# EAGLE schematic StepToneGenerator (EAGLE 7.5.0)
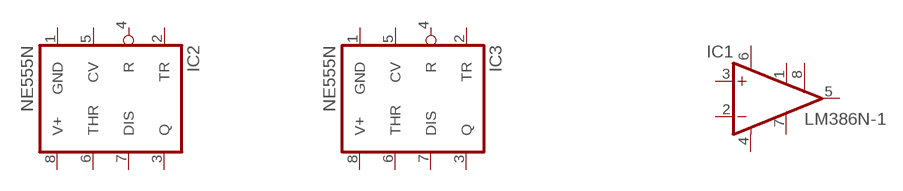
[diagram p0: schematic, sheet 1]

## Parts
IC1  LM386N-1  [DIL08]
IC2  NE555N  [DIL08-ROUND]
IC3  NE555N  [DIL08-ROUND]
Unconnected: IC1.1(GAIN) IC1.2(-IN) IC1.3(+IN) IC1.5(OUT) IC1.7(BYPASS) IC1.8(GAIN) IC2.2(TR) IC2.3(Q) IC2.4(R) IC2.5(CV) IC2.6(THR) IC2.7(DIS) IC3.2(TR) IC3.3(Q) IC3.4(R) IC3.5(CV) IC3.6(THR) IC3.7(DIS)

## Power pins joined to a net without a drawn wire
GND: IC1.4(GND) IC2.1(GND) IC3.1(GND)
V+: IC2.8(V+) IC3.8(V+)
VS: IC1.6(VS)

## Library data of the parts
IC1 = linear:LM386?-*: Low Voltage Audio Power Amplifier Source: http://cache.national.com/ds/LM/LM386.pdf
IC2 IC3 = adafruit:*555: TIMER Changed DIP package to have round (not oval) pin pads http://www.ladyada.net/library/pcb/eaglelibrary.html